# EAGLE design scheme (EAGLE 6.3)
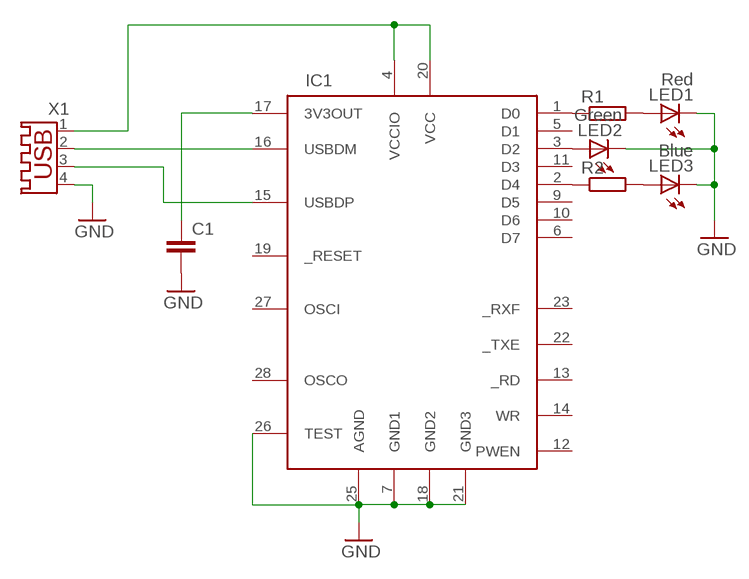
[diagram p0: schematic, sheet 1]

## Parts
C1  C-EUC0805  [C0805]
IC1  FT245RL  [SSOP28DB]
LED1  Red  LED5MM  [LED5MM]
LED2  Green  LED5MM  [LED5MM]
LED3  Blue  LED3MM  [LED3MM]
R1  R-EU_0204/5  [0204/5]
R2  R-EU_0204/5  [0204/5]
X1  USB-A003  [USB-A003]

## Nets
GND: C1.2 IC1.7(GND1) IC1.18(GND2) IC1.21(GND3) IC1.25(AGND) IC1.26(TEST) LED1.K(C) LED2.K(C) LED3.K(C) X1.4
N$1: IC1.4(VCCIO) IC1.20(VCC) X1.1
N$2: IC1.16(USBDM) X1.2
N$3: IC1.15(USBDP) X1.3
N$4: IC1.1(D0) R1.1
N$5: IC1.2(D4) R2.1
N$6: IC1.3(D2) LED2.A
N$7: LED3.A R2.2
N$8: LED1.A R1.2
N$9: C1.1 IC1.17(3V3OUT)
Unconnected: IC1.5(D1) IC1.6(D7) IC1.9(D5) IC1.10(D6) IC1.11(D3) IC1.12(PWEN) IC1.13(_RD) IC1.14(WR) IC1.19(_RESET) IC1.22(_TXE) IC1.23(_RXF) IC1.27(OSCI) IC1.28(OSCO)

## Library data of the parts
C1 = rcl:C-EU: CAPACITOR, European symbol
IC1 = ftdichip-3:FT245RL: USB FIFO Controller 4th Generation USB Controller (USB <-> Parallel) - FIFO
LED1-LED3 = led:LED: LED OSRAM: - CHIPLED LG R971, LG N971, LY N971, LG Q971, LY Q971, LO R971, LY R971 LH N974, LH R974 LS Q976, LO Q976, LY Q976 LO Q996 - Hyper CHIPLED LW Q18S LB Q993, LB Q99A, LB R99A - SideLED LS A670, LO A670, LY A670, LG A670, LP A670 LB A673, LV A673, LT A673, LW A673 LH A674 LY A675 LS A676, LA A676, LO A676, LY A676, LW A676 LS A679, LY A679, LG A679 - Hyper Micro SIDELED® LS Y876, LA Y876, LO Y876, LY Y876 LT Y87S - SmartLED LW L88C, LW L88S LB L89C, LB L89S, LG L890 LS L89K, LO L89K, LY L89K LS L896, LA L896, LO L896, LY L896 - TOPLED LS T670, LO T670, LY T670, LG T670, LP T670 LSG T670, LSP T670, LSY T670, LOP T670, LYG T670 LG T671, LOG T671, LSG T671 LB T673, LV T673, LT T673, LW T673 LH T674 LS T676, LA T676, LO T676, LY T676, LB T676, LH T676, LSB T676, LW T676 LB T67C, LV T67C, LT T67C, LS T67K, LO T67K, LY T67K, LW E67C LS E67B, LA E67B, LO E67B, LY E67B, LB E67C, LV E67C, LT E67C LW T67C LS T679, LY T679, LG T679 LS T770, LO T770, LY T770, LG T770, LP T770 LB T773, LV T773, LT T773, LW T773 LH T774 LS E675, LA E675, LY E675, LS T675 LS T776, LA T776, LO T776, LY T776, LB T776 LHGB T686 LT T68C, LB T68C - Hyper Mini TOPLED® LB M676 - Mini TOPLED Santana® LG M470 LS M47K, LO M47K, LY M47K Source: http://www.osram.convergy.de LUXEON: - LUMILED® LXK2-PW12-R00, LXK2-PW12-S00, LXK2-PW14-U00, LXK2-PW14-V00 LXK2-PM12-R00, LXK2-PM12-S00, LXK2-PM14-U00 LXK2-PE12-Q00, LXK2-PE12-R00, LXK2-PE12-S00, LXK2-PE14-T00, LXK2-PE14-U00 LXK2-PB12-K00, LXK2-PB12-L00, LXK2-PB12-M00, LXK2-PB14-N00, LXK2-PB14-P00, LXK2-PB14-Q00 LXK2-PR12-L00, LXK2-PR12-M00, LXK2-PR14-Q00, LXK2-PR14-R00 LXK2-PD12-Q00, LXK2-PD12-R00, LXK2-PD12-S00 LXK2-PH12-R00, LXK2-PH12-S00 LXK2-PL12-P00, LXK2-PL12-Q00, LXK2-PL12-R00 Source: www.luxeon.com KINGBRIGHT: KA-3528ASYC Source: www.kingbright.com
R1 R2 = resistor:R-EU_: RESISTOR, European symbol
X1 = con-yamaichi:USB-A003: USB connector; OC_FARNELL: unknown; OC_NEWARK: unknown

## Board
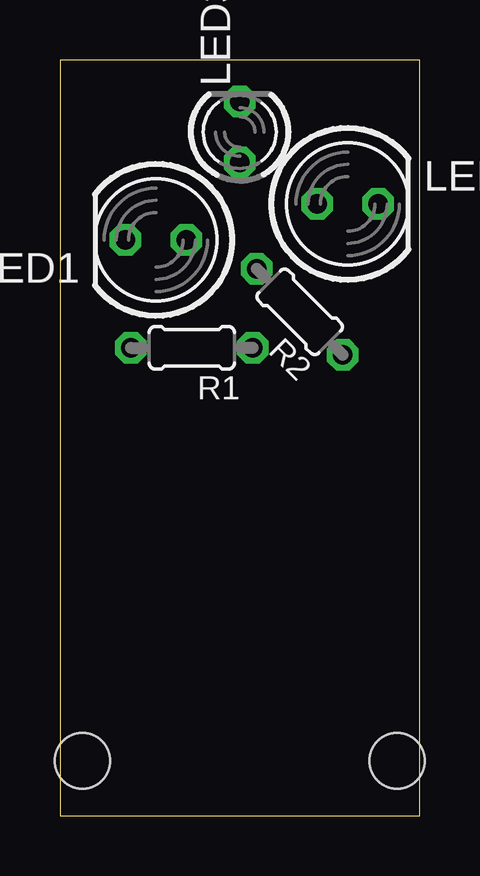
[diagram p1: board, top side]
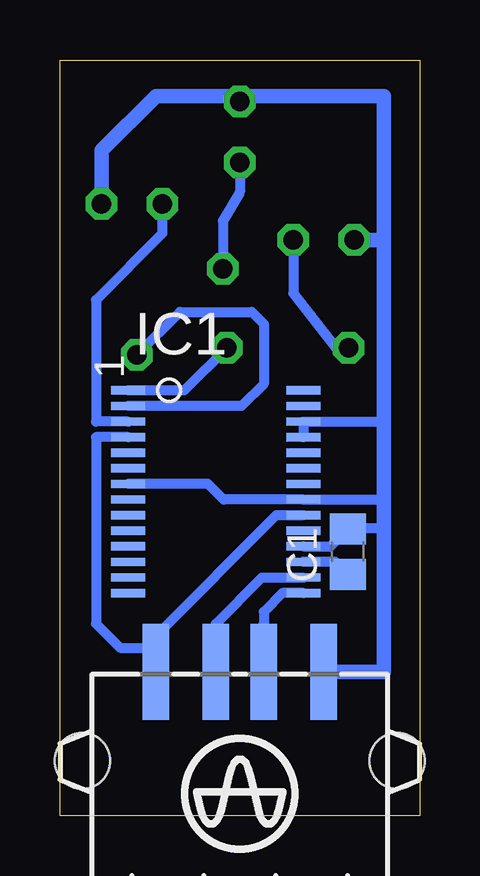
[diagram p2: board, bottom side, seen from below]

Size 15 x 31.5 mm. Coordinates in mm from the lower left corner, seen from the top.
Outline: 0,0 15,0 15,31.5 0,31.5 0,0
Copper layers (1*16): Top 0.035mm / dielectric 1.5mm / Bottom 0.035mm
Design rules "default": minimum track width 10mil, minimum drill 24mil, track to track 8mil, track to pad 8mil, pad to pad 8mil, via to via 8mil, smd to smd 8mil, copper to edge 40mil, drill to drill 8mil, minimum pad ring 10mil, minimum via ring 8mil, stop-mask expansion 4mil, vias tented up to drill 0mil, thermal gap 10mil

### Footprints (pad centres in the part's own frame; a part is rotated, then mirrored left to right if it is on the bottom)
C0805 = smd 1.3 x 1.5: 1 -0.95,0; 2 0.95,0
SSOP28DB = smd 0.348 x 1.397: 1 -4.225,-3.656; 2 -3.575,-3.656; 3 -2.925,-3.656; 4 -2.275,-3.656; 5 -1.625,-3.656; 6 -0.975,-3.656; 7 -0.325,-3.656; 8 0.325,-3.656; 9 0.975,-3.656; 10 1.625,-3.656; 11 2.275,-3.656; 12 2.925,-3.656; 13 3.575,-3.656; 14 4.225,-3.656; 15 4.225,3.656; 16 3.575,3.656; 17 2.925,3.656; 18 2.275,3.656; 19 1.625,3.656; 20 0.975,3.656; 21 0.325,3.656; 22 -0.325,3.656; 23 -0.975,3.656; 24 -1.625,3.656; 25 -2.275,3.656; 26 -2.925,3.656; 27 -3.575,3.656; 28 -4.225,3.656
LED5MM = drill 0.813 octagon: A -1.27,0; K 1.27,0
LED3MM = drill 0.813 octagon: A -1.27,0; K 1.27,0
0204/5 = drill 0.813 octagon: 1 -2.54,0; 2 2.54,0
USB-A003 = smd 1.12 x 4: 1 -3.5,14; 2 -1,14; 3 1,14; 4 3.5,14 | hole 2.3: -6.57,10.28; 6.57,10.28

### Placement (x,y rotation side)
C1  3,11 90 bottom
IC1  8.5,13.5 270 bottom
LED1  4,24 180 top
LED2  12,25.5 0 top
LED3  7.5,28.5 90 top
R1  5.5,19.5 180 top
R2  10,21 135 top
X1  7.5,-8 0 bottom

### Tracks (layer width: path | path; a pad name or v marks a point on that pad's centre or on a via)
GND
  Bottom 0.406: 1.5,16.5 1.5,16.43 IC1.26 IC1.25 | 1.5,13.22 1.5,13.18 | 1.5,13.18 IC1.21 8.18,13.18 8.82,13.82 IC1.7 | 1.5,13.18 1.5,13 | IC1.18 3.73,11.22 C1.2 2.55,11.95 2.55,12 1.5,12
  Bottom 0.61: X1.4 1.5,6 1.5,12 1.5,13 1.5,13.22 1.5,16.5 1.5,24 | 1.5,24 1.5,30 7.5,30 | 7.5,30 11,30 13.27,27.73 LED2.K | LED1.K 1.5,24 | LED3.K 7.5,30
N$1
  Bottom 0.406: X1.1 11,7 | 11,7 11,7.5 5.97,12.53 IC1.20 | IC1.4 13.5,15.78 13.5,8 12.5,7 11,7
N$2
  Bottom 0.406: X1.2 8.5,8 6.58,9.93 IC1.16
N$3
  Bottom 0.406: X1.3 6.5,7 6.5,8 6.5,8.5 5.72,9.28 IC1.15
N$4
  Bottom 0.406: R1.1 9.81,17.73 IC1.1
N$5
  Bottom 0.406: R2.1 10,21 7,21 6.5,20.5 6.5,18 7.42,17.07 IC1.2
N$6
  Bottom 0.406: IC1.3 13.5,16.43 13.5,21.5 10.73,24.27 LED2.A
N$7
  Bottom 0.406: R2.2 8.2,24.8 7.5,26 LED3.A
N$8
  Bottom 0.406: LED1.A 5.27,21.77 3.5,19.5 R1.2
N$9
  Bottom 0.406: C1.1 3.52,10.57 IC1.17